# Altium schematic sheet For_LCD5110.SchDoc: Repeating a sequence
size A4; Author: Idolova Anna; Revision: Version 1.0; SheetNumber: 2; SheetTotal: 2
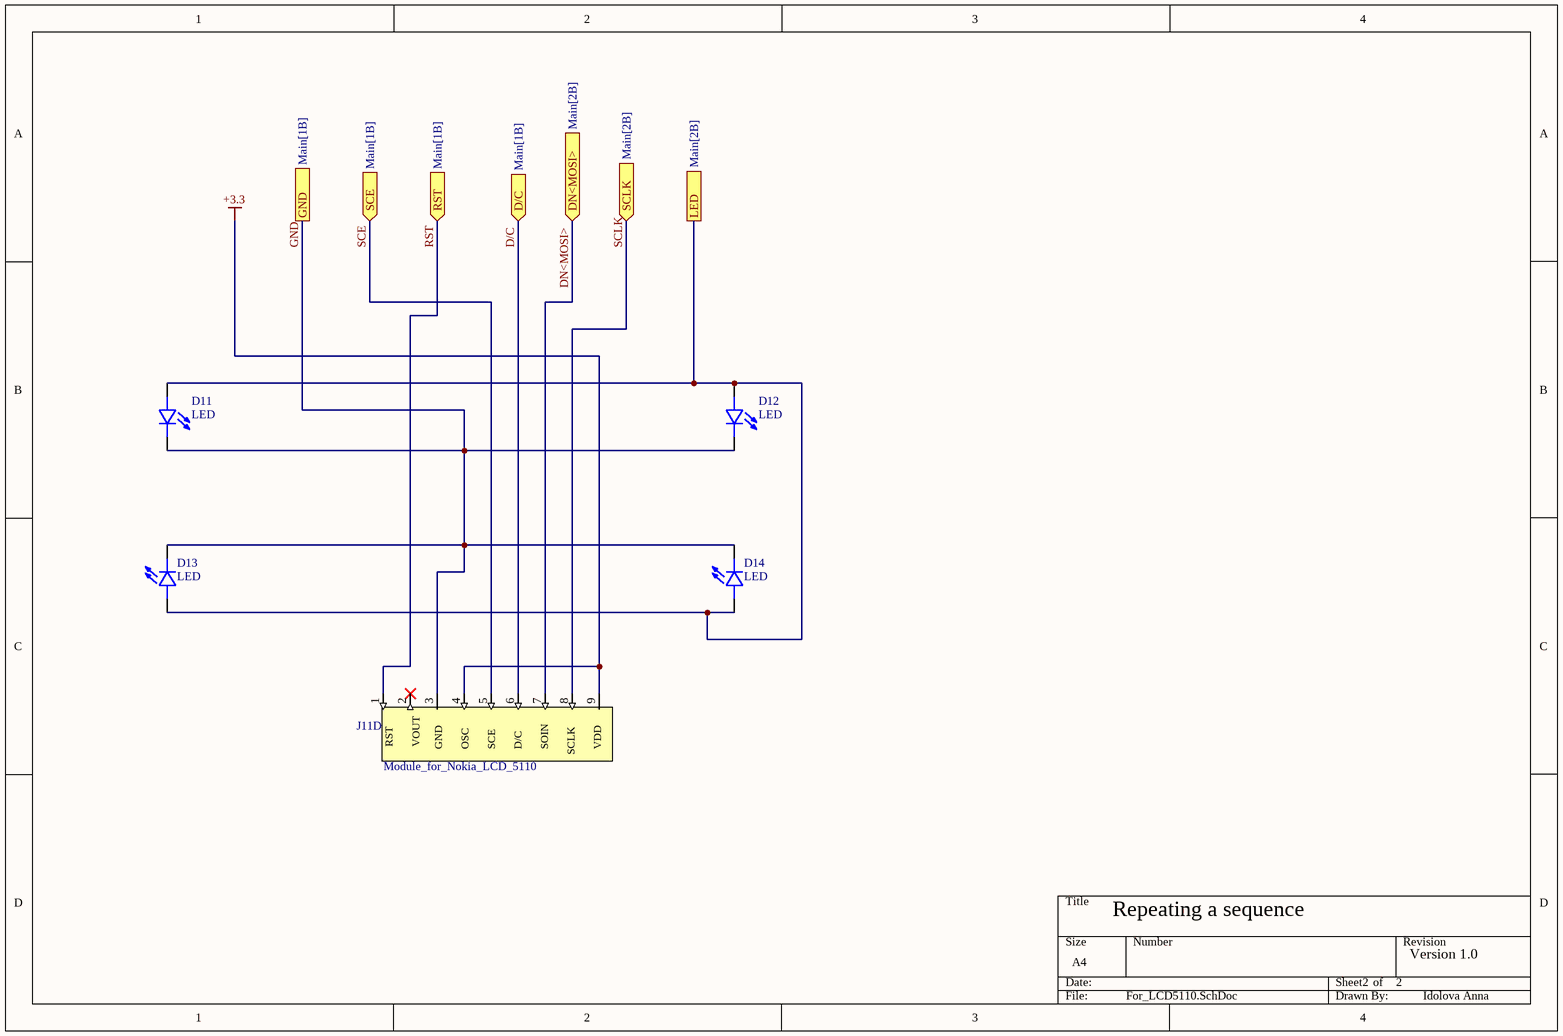
[diagram p0: For_LCD5110.SchDoc]

## Parts
D11  LED  [LED_LTW-170TK]
D12  LED  [LED_LTW-170TK]
D13  LED  [LED_LTW-170TK]
D14  LED  [LED_LTW-170TK]
J11  Module_for_Nokia_LCD_5110  [PCBComponent_1]  (part D of 4)

## Ports
D/C (in, see Main[1B]), DN<MOSI> (in, see Main[2B]), GND (see Main[1B]), LED (see Main[2B]), RST (in, see Main[1B]), SCE (in, see Main[1B]), SCLK (in, see Main[2B])

## Nets
+3.3: J11.4 J11.9
D/C: J11.6 ; port D/C
DN<MOSI>: J11.7 ; port DN<MOSI>
GND: D11.C D12.C D13.C D14.C J11.3 ; port GND
LED: D11.A D12.A D13.A D14.A ; port LED
RST: J11.1 ; port RST
SCE: J11.5 ; port SCE
SCLK: J11.8 ; port SCLK

Not connected (* = marked no-connect by the designer): J11 2*

## Notes on the sheet
- (in symbol Module_for_Nokia_LCD_5110, part D) RST; VOUT; GND; OSC; SCE; D/C; SOIN; VDD; SCLK

## Library data of the parts
D11-D14 = CMP-004-00039-1: White - LED Indication - Discrete 3.3V 0805 (2012 Metric); MF: Lite-On Inc.; SnapEDA_Link: https://www.snapeda.com/parts/LTW-170TK/Lite-On/view-part/?ref=snap; Pins: 2; Check_prices: https://www.snapeda.com/parts/LTW-170TK/Lite-On/view-part/?ref=eda; Design Item ID: LTW-170TK; Source: LTW-170TK.SchLib; Component Type: Standard; Case/Package: 0805 Lite-On; Value: *; MP: LTW-170TK